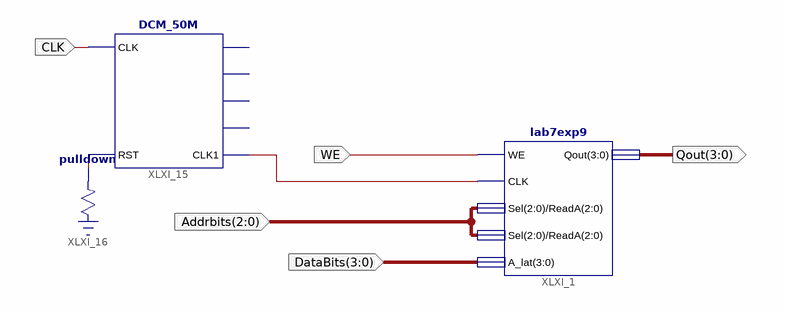
[diagram p0: schematic sheet 1]
// Xilinx ISE schematic L7exp9final.sch (spartan3e) as structural Verilog: 3 symbols, 5 ports
module L7exp9final (
  input  WE,
  input  CLK,
  input  [2:0] Addrbits,
  input  [3:0] DataBits,
  output [3:0] Qout
);

  wire XLXN_77, XLXN_78;

  lab7exp9 XLXI_1 (.WE(WE), .CLK(XLXN_78), .Sel(Addrbits), .ReadA(Addrbits), .A_lat(DataBits), .Qout(Qout));
  DCM_50M XLXI_15 (.CLK(CLK), .RST(XLXN_77), .CLK1(XLXN_78));  // open: CLK1M, CLK10k, CLK1k, CLK100
  \pulldown  XLXI_16 (.O(XLXN_77));
endmodule
